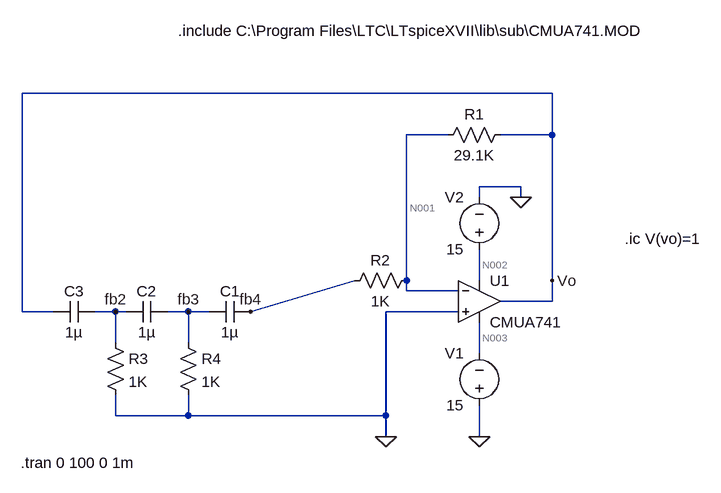
[diagram p0: schematic Part B circuit.asc]
Part B circuit.asc, the LTspice schematic file:
Version 4
SHEET 1 1204 680
WIRE 368 -176 -448 -176
WIRE 208 -112 144 -112
WIRE 368 -112 368 -176
WIRE 368 -112 288 -112
WIRE 320 -32 256 -32
WIRE 256 -16 256 -32
WIRE 320 -16 320 -32
WIRE 144 112 144 -112
WIRE 256 112 256 64
WIRE 368 112 368 -112
WIRE 144 128 144 112
WIRE 224 128 144 128
WIRE 368 144 368 112
WIRE 368 144 288 144
WIRE -448 160 -448 -176
WIRE -400 160 -448 160
WIRE -304 160 -336 160
WIRE -288 160 -304 160
WIRE -192 160 -224 160
WIRE -160 160 -192 160
WIRE -96 160 64 112
WIRE 224 160 112 160
WIRE -304 208 -304 160
WIRE -192 208 -192 160
WIRE 256 224 256 176
WIRE -304 320 -304 288
WIRE -192 320 -192 288
WIRE -192 320 -304 320
WIRE 112 320 112 160
WIRE 112 320 -192 320
WIRE 112 352 112 320
WIRE 256 352 256 304
FLAG 256 352 0
FLAG 320 -16 0
FLAG 112 352 0
FLAG 368 112 Vo
FLAG -304 160 fb2
FLAG -192 160 fb3
FLAG -96 160 fb4
SYMBOL OpAmps\\opamp2 256 80 R0
SYMATTR InstName U1
SYMATTR Value CMUA741
SYMBOL voltage 256 320 R180
WINDOW 0 24 96 Left 2
WINDOW 3 24 16 Left 2
WINDOW 123 0 0 Left 0
WINDOW 39 0 0 Left 0
SYMATTR InstName V1
SYMATTR Value 15
SYMBOL voltage 256 80 R180
WINDOW 0 24 96 Left 2
WINDOW 3 24 16 Left 2
WINDOW 123 0 0 Left 0
WINDOW 39 0 0 Left 0
SYMATTR InstName V2
SYMATTR Value 15
SYMBOL res 304 -128 R90
WINDOW 0 0 56 VBottom 2
WINDOW 3 32 56 VTop 2
SYMATTR InstName R1
SYMATTR Value 29.1K
SYMBOL res 160 96 R90
WINDOW 0 0 56 VBottom 2
WINDOW 3 32 56 VTop 2
SYMATTR InstName R2
SYMATTR Value 1K
SYMBOL cap -96 144 R90
WINDOW 0 0 32 VBottom 2
WINDOW 3 32 32 VTop 2
SYMATTR InstName C1
SYMATTR Value 1µ
SYMBOL cap -224 144 R90
WINDOW 0 0 32 VBottom 2
WINDOW 3 32 32 VTop 2
SYMATTR InstName C2
SYMATTR Value 1µ
SYMBOL cap -336 144 R90
WINDOW 0 0 32 VBottom 2
WINDOW 3 32 32 VTop 2
SYMATTR InstName C3
SYMATTR Value 1µ
SYMBOL res -320 192 R0
SYMATTR InstName R3
SYMATTR Value 1K
SYMBOL res -208 192 R0
SYMATTR InstName R4
SYMATTR Value 1K
TEXT -208 -272 Left 2 !.include C:\\Program Files\\LTC\\LTspiceXVII\\lib\\sub\\CMUA741.MOD
TEXT -450 392 Left 2 !.tran 0 100 0 1m
TEXT 480 48 Left 2 !.ic V(vo)=1

The netlist it stands for:
* Part B circuit.asc
XU1 0 N001 N002 N003 Vo CMUA741  ; pins In+ In- V+ V- OUT
V1 0 N003 15
V2 N002 0 15
R1 Vo N001 29.1K
R2 N001 fb4 1K
C1 fb4 fb3 1µ
C2 fb3 fb2 1µ
C3 fb2 Vo 1µ
R3 fb2 0 1K
R4 fb3 0 1K
.include C:\Program Files\LTC\LTspiceXVII\lib\sub\CMUA741.MOD
.tran 0 100 0 1m
.ic V(vo)=1
.backanno
.end

* Results of the author's LTspice run, read from the files saved beside the schematic
* Operating Point, zero values left out:
*   V(vo) = 1 V
*   V(n003) = -15 V
*   V(n002) = 15 V
*   V(n001) = 995.3 mV
*   V(fb4) = 995.3 mV
*   I(R1) = 160.3 nA
*   I(V2) = -1.667 mA
*   I(V1) = -1.667 mA
*   Ix(u1:1) = -15.37 pA
*   Ix(u1:2) = 160.3 nA
*   Ix(u1:3) = 1.667 mA
*   Ix(u1:4) = -1.667 mA
*   Ix(u1:5) = 25.61 mA